# Altium schematic sheet M5311module.SchDoc
size A4
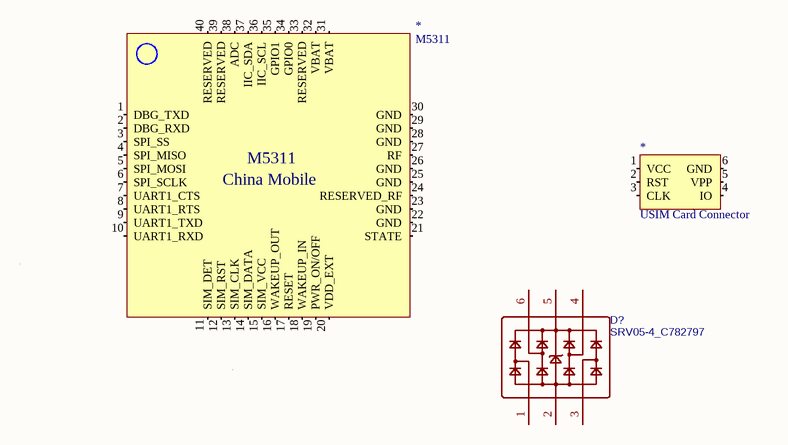
[diagram p0: M5311module.SchDoc]

## Parts
(Parts that share a designator on the sheet are numbered #1, #2 ... from top to bottom, then left to right.)
*#1  USIM Card Connector  [SIM-SMD_SMO-1512]
*#2  M5311  [M5311]
D?  SRV05-4_C782797  [SOT-23-6_L2.9-W1.6-P0.95-LS2.8-BR]

## Nets

Not connected (* = marked no-connect by the designer): *#1 1(VCC) 2(RST) 3(CLK) 4(IO) 5(VPP) 6(GND); *#2 1(DBG_TXD) 2(DBG_RXD) 3(SPI_SS) 4(SPI_MISO) 5(SPI_MOSI) 6(SPI_SCLK) 7(UART1_CTS) 8(UART1_RTS) 9(UART1_TXD) 10(UART1_RXD) 11(SIM_DET) 12(SIM_RST) 13(SIM_CLK) 14(SIM_DATA) 15(SIM_VCC) 16(WAKEUP_OUT) 17(RESET) 18(WAKEUP_IN) 19(PWR_ON/OFF) 20(VDD_EXT) 21(STATE) 22(GND) 23(GND) 24(RESERVED_RF) 25(GND) 26(GND) 27(RF) 28(GND) 29(GND) 30(GND) 31(VBAT) 32(VBAT) 33(RESERVED) 34(GPIO0) 35(GPIO1) 36(IIC_SCL) 37(IIC_SDA) 38(ADC) 39(RESERVED) 40(RESERVED); D? 1 2 3 4 5 6

## Notes on the sheet
- (in symbol M5311) China Mobile

## Library data of the parts
D? = SRV05-4_C782797: BOM_Manufacturer: SEMBO; Contributor: LCSC; BOM_Supplier: LCSC; BOM_Supplier Part: C782797; BOM_Manufacturer Part: SRV05-4; spicePre: D; spiceSymbolName: SRV05-4_C782797